# EAGLE design RTC-SHIM (EAGLE 9.6.2)
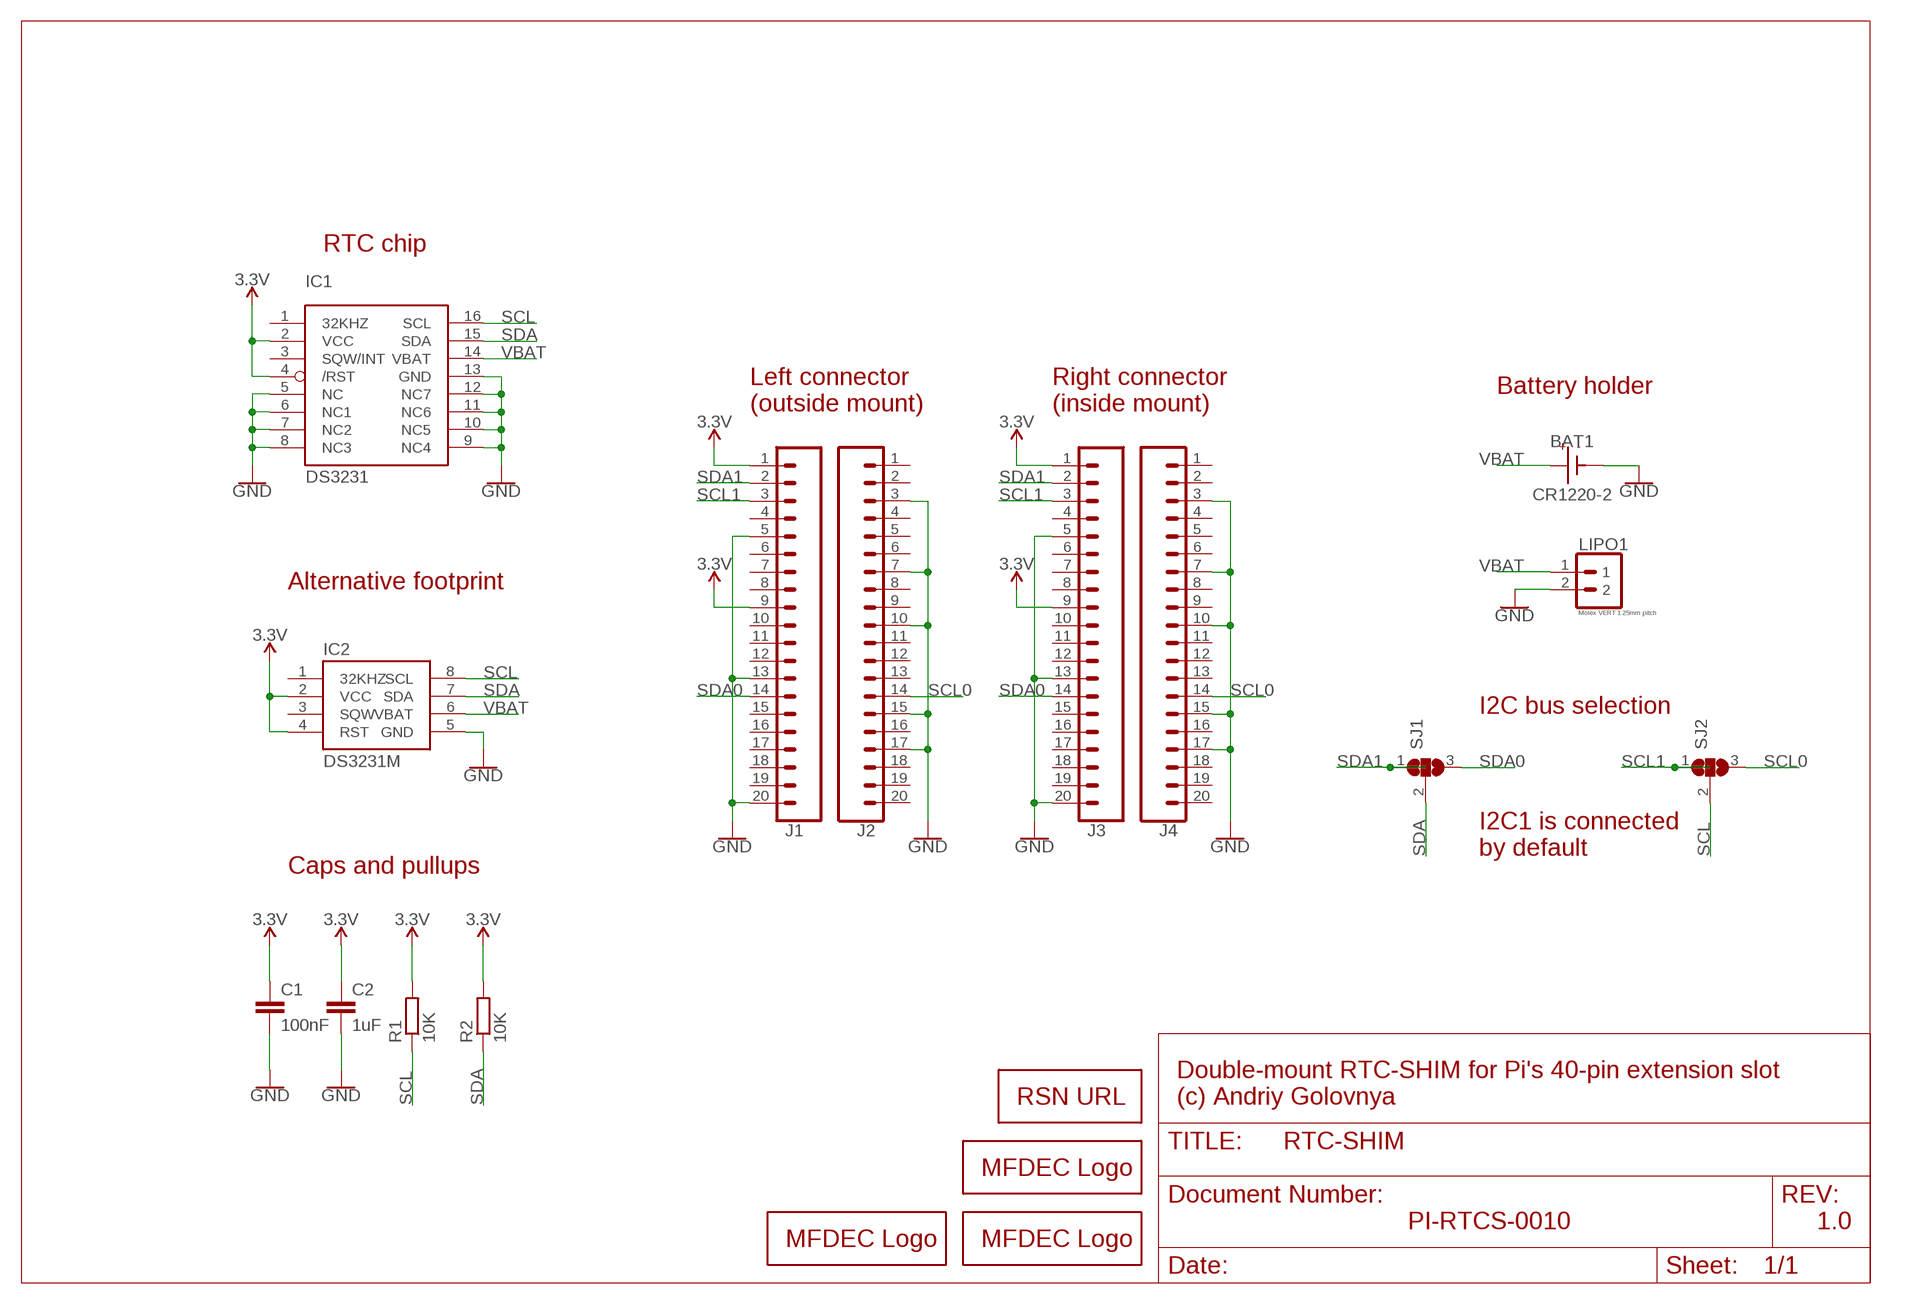
[diagram p0: schematic, sheet 1]

## Parts
BAT1  CR1220-2  [CR1220-2]
C1  100nF  C-EUC0402  [C0402]
C2  1uF  C-EUC0603  [C0603]
IC1  DS3231/SO  [SO16W]
IC2  DS3231M  [SO08]
J1  CONN_20LOCK  [1X20_LOCK]
J2  CONN_20LOCK  [1X20_LOCK]
J3  CONN_20LOCK  [1X20_LOCK]
J4  CONN_20LOCK  [1X20_LOCK]
LIPO1  Molex VERT 1.25mm pitch  1X02_MOLEX_0530470210_VERT-MALE_PITCH-1.25MM  [_MOLEX-0530470210_VERT_PITCH-1.25MM]
LOGO1  MFDECLOGO_SQ_8MM  [MFDEC_SQ_8MM]
LOGO2  MFDECLOGO_L_20MM  [MFDEC_L_20MM]
LOGO3  RSNURL_QR_10MM  [RSNURL_QR_10MM]
LOGO4  MFDECLOGO_L_10MM  [MFDEC_L_10MM]
R1  10K  R-EU_R0402  [R0402]
R2  10K  R-EU_R0402  [R0402]
SJ1  SJ2  [SJ_2]
SJ2  SJ2  [SJ_2]

## Nets
3.3V: C1.1 C2.1 IC1.2(VCC) IC1.4(/RST) IC2.2(VCC) IC2.4(RST) J1.1 J1.9 J3.1 J3.9 R1.2 R2.2
GND: BAT1.BAT- C1.2 C2.2 IC1.5(NC) IC1.6(NC1) IC1.7(NC2) IC1.8(NC3) IC1.9(NC4) IC1.10(NC5) IC1.11(NC6) IC1.12(NC7) IC1.13(GND) IC2.5(GND) J1.5 J1.13 J1.20 J2.3 J2.7 J2.10 J2.15 J2.17 J3.5 J3.13 J3.20 J4.3 J4.7 J4.10 J4.15 J4.17 LIPO1.2
SCL: IC1.16(SCL) IC2.8(SCL) R1.1 SJ2.2
SCL0: J2.14 J4.14 SJ2.3
SCL1: J1.3 J3.3 SJ2.1
SDA: IC1.15(SDA) IC2.7(SDA) R2.1 SJ1.2
SDA0: J1.14 J3.14 SJ1.3
SDA1: J1.2 J3.2 SJ1.1
VBAT: BAT1.BAT+ IC1.14(VBAT) IC2.6(VBAT) LIPO1.1
Unconnected: IC1.1(32KHZ) IC1.3(SQW/INT) IC2.1(32KHZ) IC2.3(SQW) J1.4 J1.6 J1.7 J1.8 J1.10 J1.11 J1.12 J1.15 J1.16 J1.17 J1.18 J1.19 J2.1 J2.2 J2.4 J2.5 J2.6 J2.8 J2.9 J2.11 J2.12 J2.13 J2.16 J2.18 J2.19 J2.20 J3.4 J3.6 J3.7 J3.8 J3.10 J3.11 J3.12 J3.15 J3.16 J3.17 J3.18 J3.19 J4.1 J4.2 J4.4 J4.5 J4.6 J4.8 J4.9 J4.11 J4.12 J4.13 J4.16 J4.18 J4.19 J4.20

## Notes on the sheet
- RTC chip
- Battery holder
- Left connector
  (outside mount)
- Right connector
  (inside mount)
- Alternative footprint
- I2C bus selection
- I2C1 is connected
  by default
- Caps and pullups
- Double-mount RTC-SHIM for Pi's 40-pin extension slot
  (c) Andriy Golovnya
- PI-RTCS-0010 | 1.0

## Library data of the parts
BAT1 = CR1220-2:CR1220-2
C1 C2 = rcl:C-EU: CAPACITOR, European symbol; SPICEPREFIX: C
IC1 = adafruit:DS3231
IC2 = SparkFun-Clocks:DS3231M: DS3231M Real Time Clock Accuracy +/-5ppm. Battery Backup. 2.3V to 5.5V. Datasheet <https://cdn.sparkfun.com/datasheets/Dev/Beagle/DS3231M.pdf> SparkFun Products CryptoCape <https://www.sparkfun.com/products/12773> (DEV-12773) SparkFun CryptoShield <https://www.sparkfun.com/products/13183> (DEV-13183); PROD_ID: IC-11985
J1-J4 = _my_locked_connectors:CONN_20: Multi connection point. Often used as Generic Header-pin footprint for 0.1 inch spaced/style header connections On any of the 0.1 inch spaced packages, you can populate with these: Break Away Headers - Straight <https://www.sparkfun.com/products/116> (PRT-00116) Break Away Male Headers - Right Angle <https://www.sparkfun.com/products/553> (PRT-00553) Female Headers <https://www.sparkfun.com/products/115> (PRT-00115) Break Away Headers - Machine Pin <https://www.sparkfun.com/products/117> (PRT-00117) Break Away Female Headers - Swiss Machine Pin <https://www.sparkfun.com/products/743> (PRT-00743) For SCREWTERMINALS and SPRING TERMINALS visit here: Screw Terimnals on SparkFun.com <https://www.sparkfun.com/search/results?term=Screw+Terminals> (5mm/3.5mm/2.54mm spacing) This device is also useful as a general connection point to wire up your design to another part of your project. Our various solder wires solder well into these plated through hole pads. Hook-Up Wire - Assortment (Stranded, 22 AWG) <https://www.sparkfun.com/products/11375> (PRT-11375) Hook-Up Wire - Assortment (Solid Core, 22 AWG) <https://www.sparkfun.com/products/11367> (PRT-11367) View the entire wire category on our website here <https://www.sparkfun.com/categories/141> Special notes: Molex polarized connector foot print use with SKU : PRT-08231 with associated crimp pins and housings. 1MM SMD Version SKU: PRT-10208 NOTES ON THE VARIANTS LOCK and LOCK_LONGPADS... This footprint was designed to help hold the alignment of a through-hole component (i.e. 6-pin header) while soldering it into place. You may notice that each hole has been shifted either up or down by 0.005 of an inch from it's more standard position (which is a perfectly straight line). This slight alteration caused the pins (the squares in the middle) to touch the edges of the holes. Because they are alternating, it causes a "brace" to hold the component in place. 0.005 has proven to be the perfect amount of "off-center" position when using our standard breakaway headers. Although looks a little odd when you look at the bare footprint, once you have a header in there, the alteration is very hard to notice. Also,if you push a header all the way into place, it is covered up entirely on the bottom side. Note about LOCK SPECIAL package: This is just like the LOCK variant in that the holes are staggared by 5 mil, but except for the last two holes. They are not altered from the "standard" footprint layout. This is used for a special purpose on the layout of our Graphic LCD Backpack. Make sure you want to use this device before selecting it for you project!
LIPO1 = PiB_connectors:1X02_MOLEX; DATASHEET_CONNECTOR1: https://www.molex.com/pdm_docs/sd/530470210_sd.pdf; DATASHEET_CONNECTOR2: https://www.molex.com/pdm_docs/sd/510210700_sd.pdf; DATASHEET_CRIMP: https://www.molex.com/pdm_docs/sd/500798000_sd.pdf; DISTLINK_CONNECTOR1: https://www.digikey.com/products/en?keywords=WM1731-ND; DISTLINK_CONNECTOR2: https://www.digikey.com/products/en?keywords=WM1720-ND; DISTLINK_CRIMP: https://www.digikey.com/products/en?keywords=WM1142CT-ND; DISTPN_CONNECTOR1: WM1731-ND; DISTPN_CONNECTOR2: WM1720-ND; DISTPN_CRIMP: WM1142CT-ND; DIST_CONNECTOR1: Digikey; DIST_CONNECTOR2: Digikey; DIST_CRIMP: Digikey; MFR_CONNECTOR1: Molex, LLC; MFR_CONNECTOR2: Molex, LLC; MFR_CRIMP: Molex, LLC; MPN_CONNECTOR1: 0530470210; MPN_CONNECTOR2: 51021-0200; MPN_CRIMP: 0500798000
LOGO1 LOGO2 LOGO4 = _my_logos:MFDECLOGO: Midnight Fog - Digital Eye Candy LOGO
LOGO3 = _my_logos:RSNURL: RedScorp.Net URL
R1 R2 = rcl:R-EU_: RESISTOR, European symbol; SPICEPREFIX: R
SJ1 SJ2 = _my_jumpers:SJ2: SMD solder JUMPER SJ2 - simple jumper SJ2FI - fancy inside jumper SJ2FO - fancy outside jumper SJ2FL - fancy left jumper SJ2FR - fancy right jumper SJ2W - wide jumper

## Board
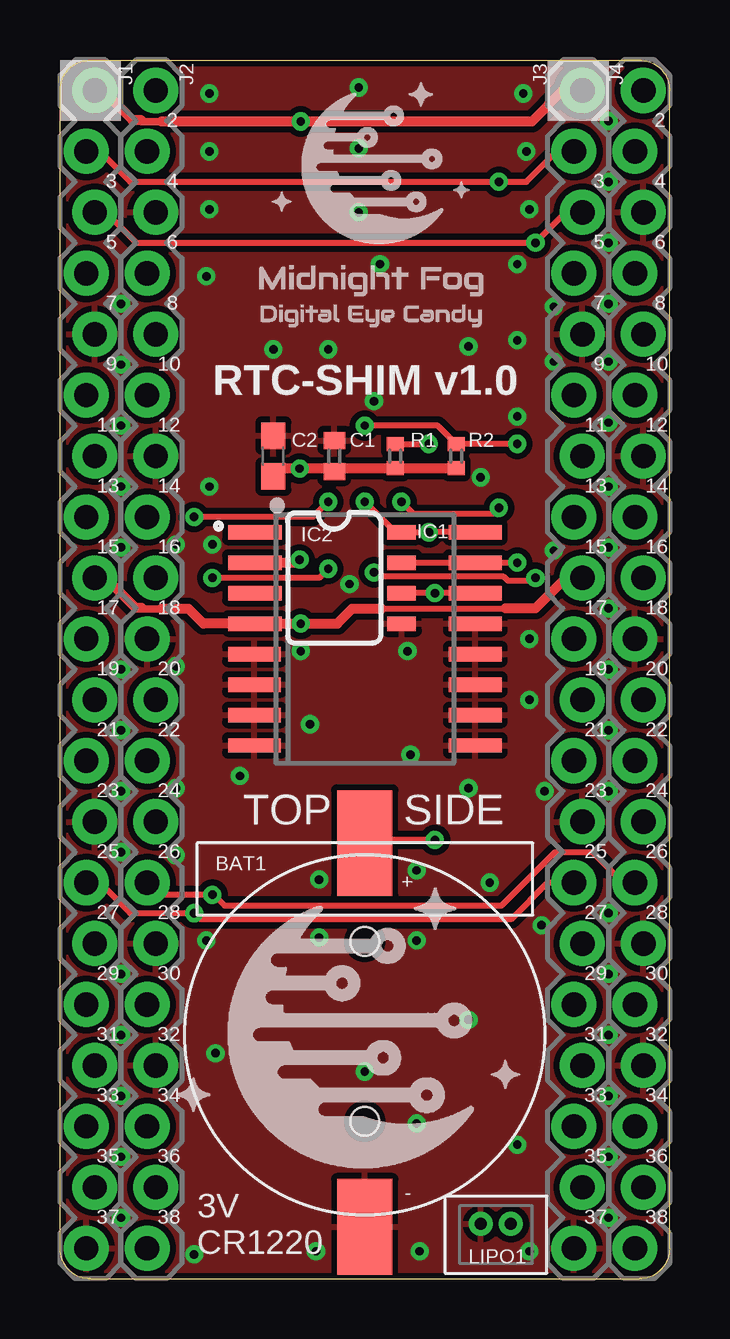
[diagram p1: board, top side]
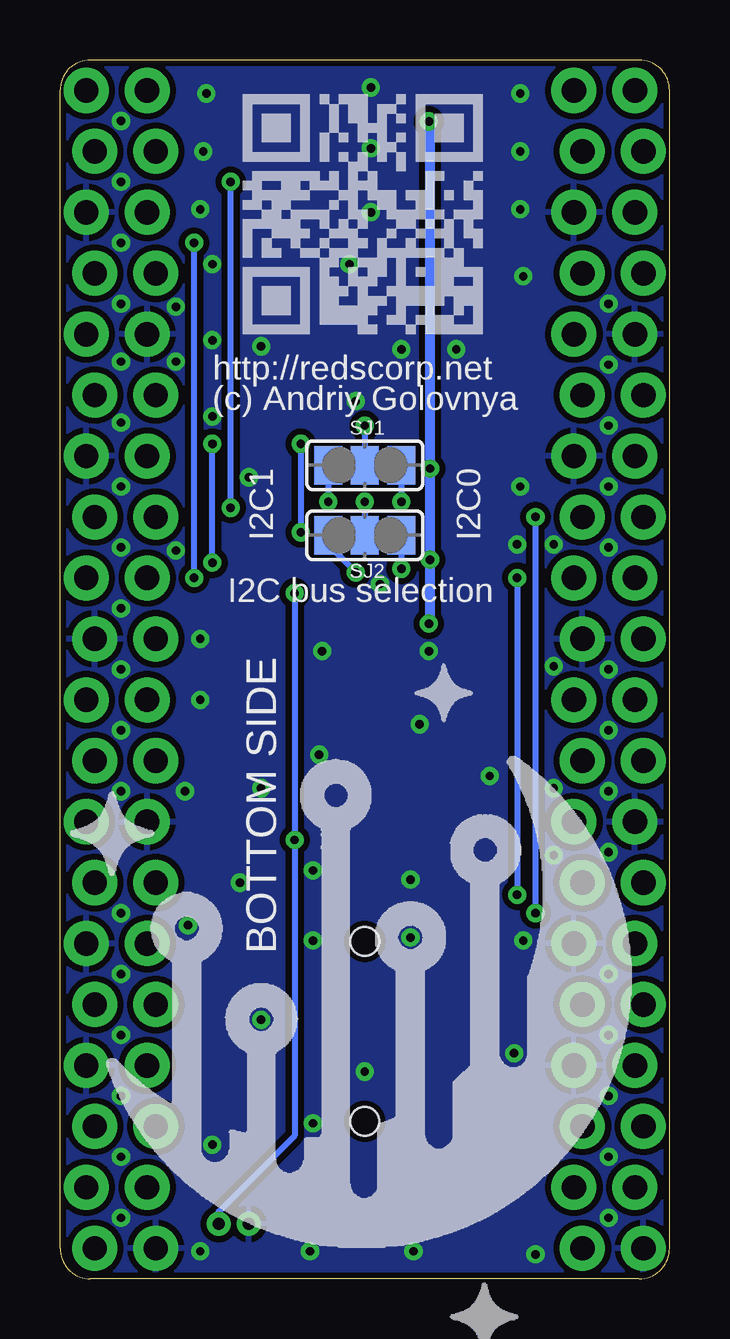
[diagram p2: board, bottom side, seen from below]

Size 25.4 x 50.8 mm. Coordinates in mm from the lower left corner, seen from the top.
Outline: 1.27,0 24.13,0 arc90 25.4,1.27 25.4,49.53 arc90 24.13,50.8 1.27,50.8 arc90 0,49.53 0,1.27 arc90 1.27,0
Copper layers (1*16): Top 0.035mm / dielectric 1.5mm / Bottom 0.035mm
Design rules "default *": minimum track width 6mil, minimum drill 0.35mm, track to track 6mil, track to pad 6mil, pad to pad 6mil, via to via 6mil, smd to smd 6mil, copper to edge 6mil, drill to drill 6mil, minimum pad ring 10mil, minimum via ring 8mil, stop-mask expansion 4mil, vias tented up to drill 20mil, thermal gap 10mil

### Footprints (pad centres in the part's own frame; a part is rotated, then mirrored left to right if it is on the bottom)
CR1220-2 = smd 2.3 x 4.4: BAT+ 0,-8 | smd 2.3 x 4: BAT- 0,8 | hole 1.2: 0,3.6; 0,-3.9
C0402 = smd 0.7 x 0.9: 1 -0.65,0; 2 0.65,0
C0603 = smd 1.1 x 1: 1 -0.85,0; 2 0.85,0
SO16W = smd 0.6 x 2.2: 1 -4.445,-4.6; 2 -3.175,-4.6; 3 -1.905,-4.6; 4 -0.635,-4.6; 5 0.635,-4.6; 6 1.905,-4.6; 7 3.175,-4.6; 8 4.445,-4.6; 9 4.445,4.6; 10 3.175,4.6; 11 1.905,4.6; 12 0.635,4.6; 13 -0.635,4.6; 14 -1.905,4.6; 15 -3.175,4.6; 16 -4.445,4.6
SO08 = smd 0.6 x 1.2: 1 -1.905,-2.8; 2 -0.635,-2.8; 3 0.635,-2.8; 4 1.905,-2.8; 5 1.905,2.8; 6 0.635,2.8; 7 -0.635,2.8; 8 -1.905,2.8
1X20_LOCK = drill 1.016 pad 1.88: 1 0,0.178; 2 2.54,-0.178; 3 5.08,0.178; 4 7.62,-0.178; 5 10.16,0.178; 6 12.7,-0.178; 7 15.24,0.178; 8 17.78,-0.178; 9 20.32,0.178; 10 22.86,-0.178; 11 25.4,0.178; 12 27.94,-0.178; 13 30.48,0.178; 14 33.02,-0.178; 15 35.56,0.178; 16 38.1,-0.178; 17 40.64,0.178; 18 43.18,-0.178; 19 45.72,0.178; 20 48.26,-0.178
_MOLEX-0530470210_VERT_PITCH-1.25MM = drill 0.5: 1 -0.625,0; 2 0.625,0
R0402 = smd 0.6 x 0.7: 1 -0.5,0; 2 0.5,0
SJ_2 = smd 1.168 x 1.6: 1 -1.524,0; 2 0,0; 3 1.524,0

### Placement (x,y rotation side)
BAT1  12.7,10.16 180 top
C1  11.43,34.29 90 top
C2  8.89,34.29 90 top
IC1  12.7,26.67 270 top
IC2  11.43,29.21 270 top
J1  1.27,49.53 270 top
J2  3.81,49.53 270 top
J3  21.59,49.53 270 top
J4  24.13,49.53 270 top
LIPO1  18.16,2.29 180 top
LOGO1  7.62,39.37 0 top
LOGO2  -0.25,-4.57 90 bottom  (outside the outline)
LOGO3  17.78,39.37 0 bottom
LOGO4  4.06,3.68 0 top
R1  13.97,34.29 270 top
R2  16.51,34.29 270 top
SJ1  12.7,33.91 0 bottom
SJ2  12.7,30.99 0 bottom

### Tracks (layer width: path | path; a pad name or v marks a point on that pad's centre or on a via)
3.3V  (via drill 0.35)
  Top 0.254: 13.39,27.91 18.54,27.91 18.57,27.94
  Top 0.305: 4.22,48.23 3.45,48.23 3.4,48.28 | 4.22,27.91 3.45,27.91 3.4,27.96
  Top 0.406: J3.1 20.95,49.53 19.66,48.23 v10.03,48.23 4.22,48.23 | J3.9 21.08,29.21 19.81,27.94 18.57,27.94 | 13.39,27.91 12.17,27.91 11.56,27.3 v10.03,27.3 IC1.4 | C2.1 9.22,33.77 v9.99,33.77 11.3,33.77 C1.1 11.58,33.79 R1.2 R2.2 | IC2.2 IC1.2 9.86,29.84 v9.99,29.97 | IC1.4 IC2.4 | IC1.4 5.97,27.3 5.36,27.91 4.22,27.91 | J1.1 1.78,49.53 3.02,48.28 3.4,48.28 | J1.9 1.91,29.21 3.15,27.96 3.4,27.96
  Bottom 0.406: v10.03,27.3 9.99,27.35 v9.99,29.97 v9.99,33.77 9.99,48.19 v10.03,48.23
GND  (via drill 0.35)
  other vias: 19.3,49.4 6.22,49.4 6.22,46.99 19.43,46.99 6.22,44.58 19.56,44.58 12.45,49.66 12.45,47.12 12.45,44.45 6.1,41.78 19.05,42.29 19.05,35.94 13.34,42.29 13.08,36.58 6.22,33.02 17.53,33.4 20.57,38.23 20.57,40.51 4.83,25.53 4.83,20.45 4.83,17.65 20.19,20.32 17.91,16.51 20.07,14.73 6.1,14.1 5.59,1.02 19.56,1.14 12.7,8.64 10.79,14.22 6.48,9.4 19.05,5.59 10.03,26.16 19.56,24.13 14.48,26.16 17.02,20.45 14.61,21.84 7.49,20.95 19.56,26.67 14.86,17.02 10.79,16.64 12.06,28.96 6.35,30.61 4.83,30.61 22.86,7.62 22.86,12.7 2.54,20.32 2.54,40.64 20.57,30.35 2.54,2.54 22.86,25.4 2.54,22.86 2.54,25.4 2.54,12.7 2.54,10.16 2.54,7.62 2.54,5.08 22.86,2.54 22.86,5.08 22.86,10.16 22.86,15.24 22.86,20.32 22.86,22.86 22.86,30.48 22.86,33.02 22.86,35.69 22.86,38.23 22.86,40.64 22.86,43.18 22.86,48.26 22.86,45.72 2.54,17.78 2.54,30.48 2.54,33.02 2.54,35.56 2.54,38.1 14.86,14.1 14.99,1.14 10.67,1.14 8.89,38.73 19.05,39.12 17.02,38.86 22.86,27.94 11.18,38.73 14.86,6.48 17.02,10.79 10.41,23.11
  pour Top (isolate 0.254): 0,0 0,50.8 28.07,50.8 28.07,0
  pour Bottom (isolate 0.254): 0,0 0,50.8 30.61,50.8 30.61,0
SCL  (via drill 0.35)
  Top 0.254: R1.1 v15.36,34.79 v15.37,34.8 | IC1.16 v15.37,31.11 IC2.8 13.98,31.11 v12.71,32.38 v12.7,32.38
  Bottom 0.254: v15.37,34.8 v15.37,31.11 | v12.7,32.38 SJ2.2
SCL0  (via drill 0.35)
  Top 0.254: J2.14 4.19,16 v6.35,16 6.41,16 6.86,15.55 18.4,15.55 20.63,17.78 22.17,17.78 23.44,16.51 J4.14 | v11.18,29.59 10.79,29.21 v6.35,29.21
  Bottom 0.254: SJ2.3 v11.18,29.59 | v6.35,29.21 v6.35,16
SCL1  (via drill 0.35)
  Top 0.254: J1.3 1.91,44.45 3.17,43.18 v19.81,43.18 21.08,44.45 J3.3 | v13.08,29.44 13.26,29.26 18.49,29.26 18.67,29.08 19.68,29.08 v19.81,29.21
  Bottom 0.152: SJ2.1 13.26,30.99
  Bottom 0.254: v13.08,29.44 13.08,29.46 14.22,30.61 SJ2.1 | v19.81,29.21 v19.81,43.18
SDA  (via drill 0.35)
  Top 0.254: v12.7,35.56 15.74,35.56 R2.1 v19.04,34.79 v19.05,34.8 | v19.05,29.84 IC1.15 IC2.7
  Bottom 0.254: v19.05,29.84 v19.05,34.8 | v12.7,35.56 SJ1.2
SDA0  (via drill 0.35)
  Top 0.254: J1.14 1.65,16.51 2.92,15.24 v5.59,15.24 5.84,14.99 18.8,14.99 20.32,16.51 J3.14 | v11.18,32.38 10.54,31.75 v5.59,31.75
  Bottom 0.254: SJ1.3 v11.18,32.38 | v5.59,31.75 v5.59,15.24
SDA1  (via drill 0.35)
  Top 0.254: J3.2 20.7,46.99 19.43,45.72 v18.29,45.72 2.92,45.72 1.65,46.99 J1.2 | v14.22,32.38 14.73,31.88 18.03,31.88 v18.29,32.13
  Bottom 0.152: SJ1.1 13.26,33.91
  Bottom 0.254: SJ1.1 v14.22,32.38 | v18.29,32.13 v18.29,45.72
VBAT  (via drill 0.35)
  Top 0.254: v15.62,18.29 12.83,18.29 BAT1.BAT+ | IC1.14 v15.62,28.57 IC2.6
  Bottom 0.254: v15.62,28.57 v15.62,18.29 15.62,5.96 18.79,2.79 LIPO1.1

### Text on the board
tPlace: 2 | 2 | 3 | 4 | 3 | 4 | 5 | 6 | 5 | 6 | 7 | 8 | 7 | 8 | 9 | 10 | 9 | 10 | RTC-SHIM v1.0 | 11 | 12 | 11 | 12 | 13 | 14 | 13 | 14 | 15 | 16 | 15 | 16 | 17 | 18 | 17 | 18 | 19 | 20 | 19 | 20 | 21 | 22 | 21 | 22 | 23 | 24 | 23 | 24 | TOP SIDE | 25 | 26 | 25 | 26 | + | 27 | 28 | 27 | 28 | 29 | 30 | 29 | 30 | 31 | 32 | 31 | 32 | 33 | 34 | 33 | 34 | 35 | 36 | 35 | 36 | - | 37 | 38 | 37 | 38 | 3V / CR1220
bPlace: http://redscorp.net | (c) Andriy Golovnya | I2C0 | I2C1 | I2C bus selection | BOTTOM SIDE